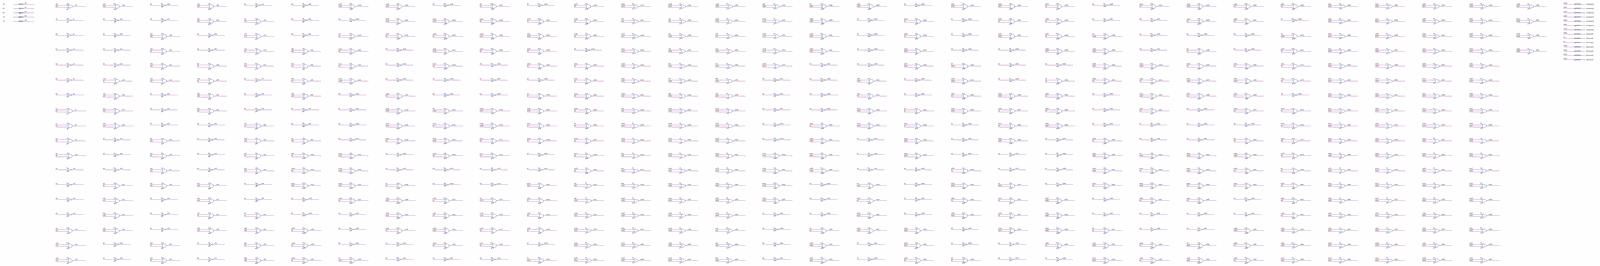
[diagram p0: schematic sheet, whole]
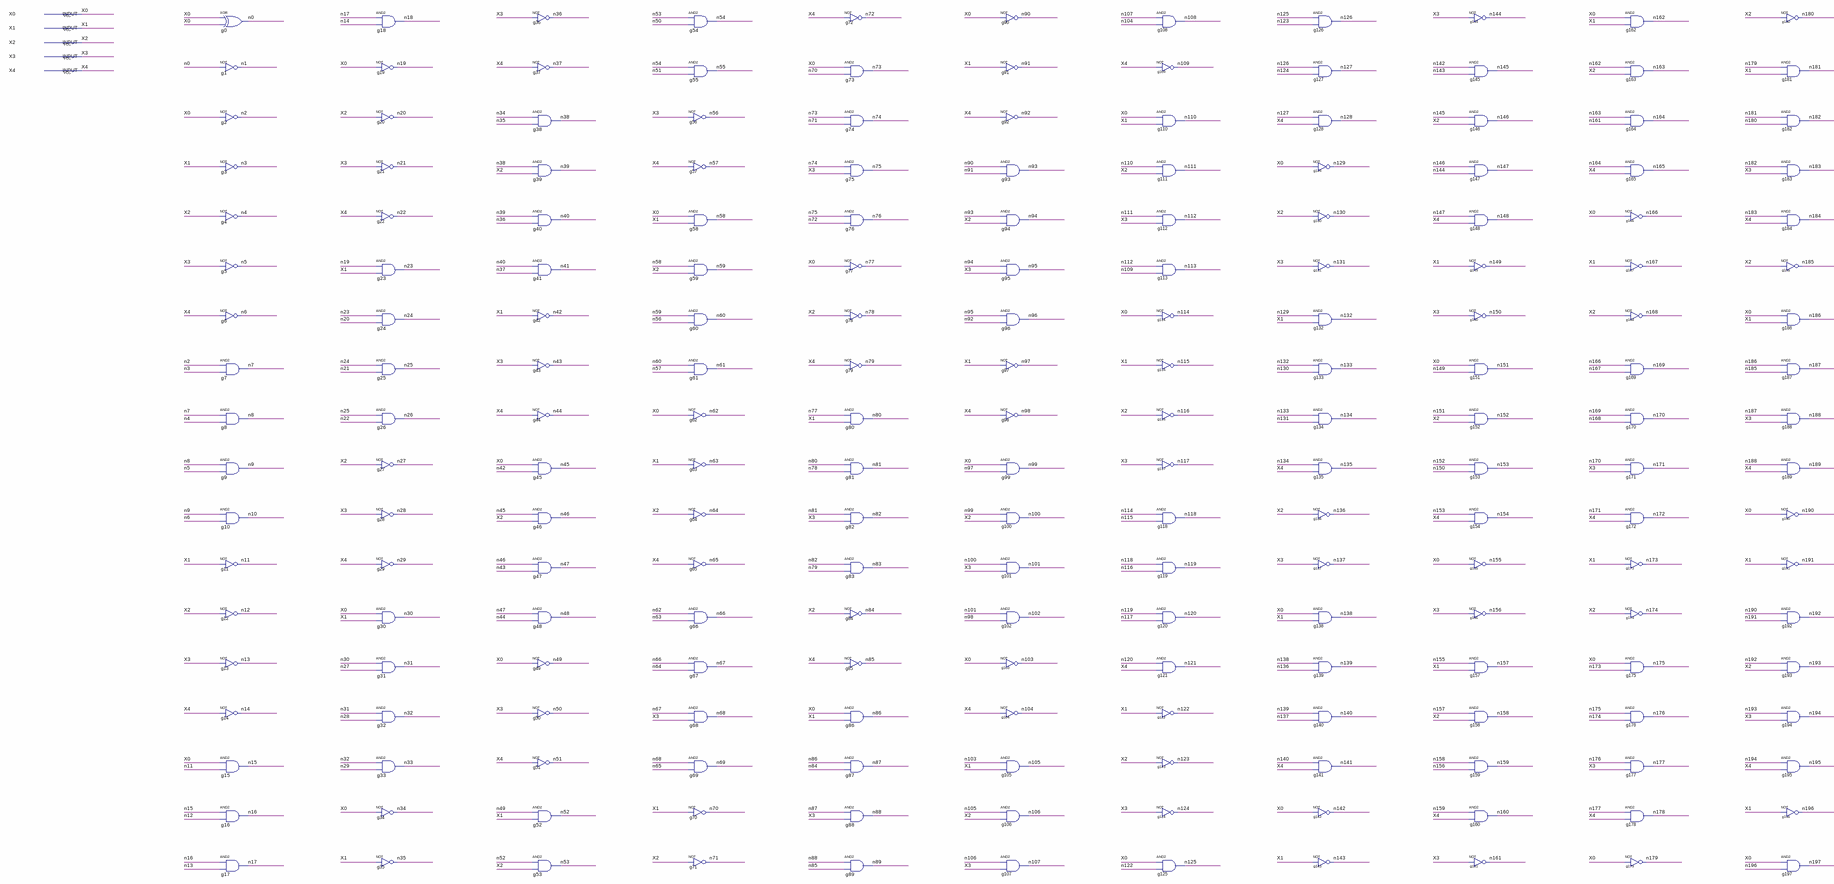
[diagram p1: schematic sheet, left part]
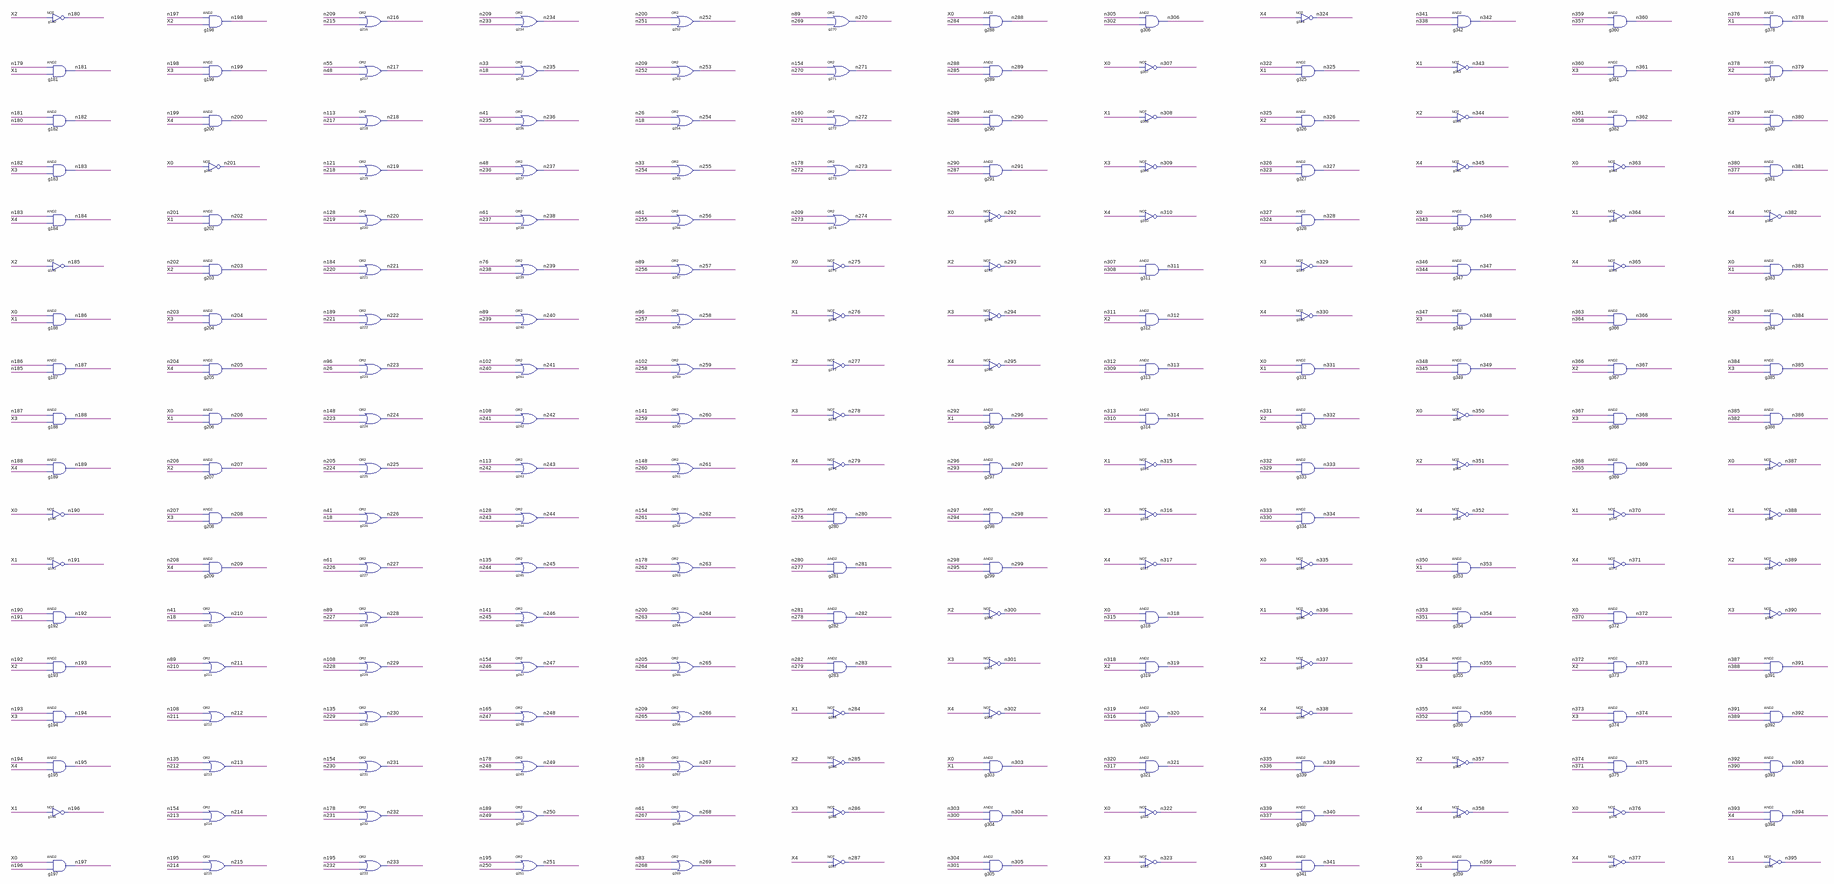
[diagram p2: schematic sheet, centre part]
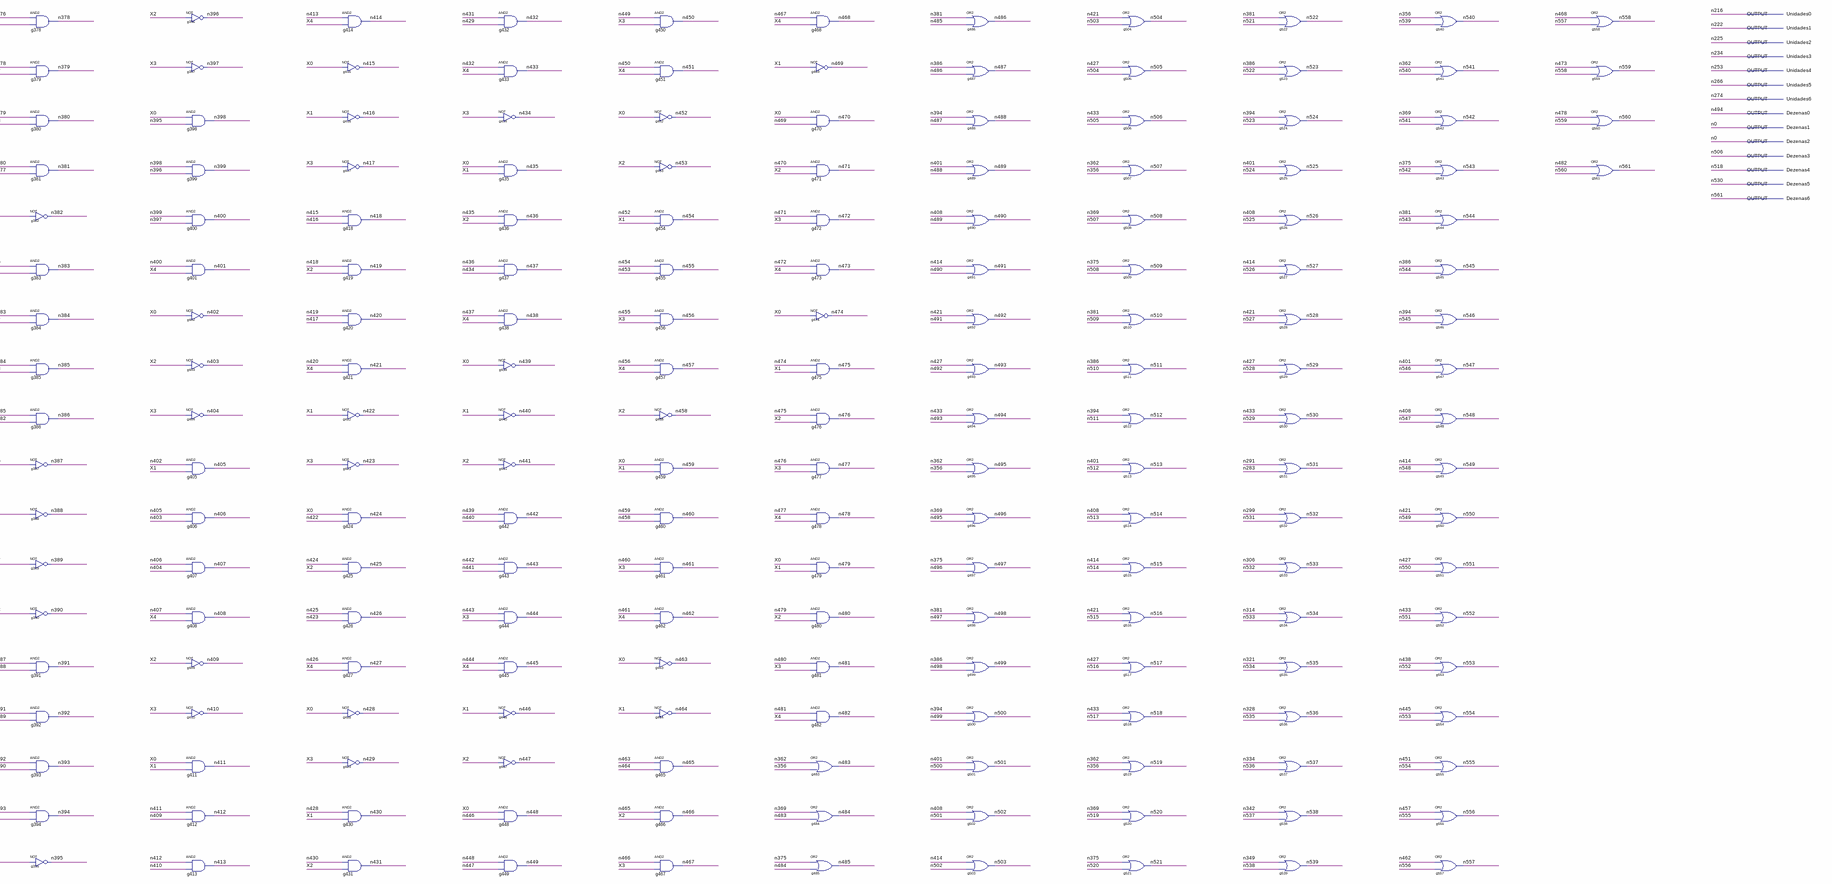
[diagram p3: schematic sheet, right part]
// Quartus schematic decoder_7seg.bdf as structural Verilog: 562 symbols, 19 pins
module decoder_7seg (
  input  X0,
  input  X1,
  input  X2,
  input  X3,
  input  X4,
  output Unidades0,
  output Unidades1,
  output Unidades2,
  output Unidades3,
  output Unidades4,
  output Unidades5,
  output Unidades6,
  output Dezenas0,
  output Dezenas1,
  output Dezenas2,
  output Dezenas3,
  output Dezenas4,
  output Dezenas5,
  output Dezenas6
);

  wire n1, n2, n3, n4, n5, n6, n7, n8, n9, n10, n11, n12, n13, n14, n15, n16, n17, n18, n19, n20, n21, n22,
       n23, n24, n25, n26, n27, n28, n29, n30, n31, n32, n33, n34, n35, n36, n37, n38, n39, n40, n41, n42,
       n43, n44, n45, n46, n47, n48, n49, n50, n51, n52, n53, n54, n55, n56, n57, n58, n59, n60, n61, n62,
       n63, n64, n65, n66, n67, n68, n69, n70, n71, n72, n73, n74, n75, n76, n77, n78, n79, n80, n81, n82,
       n83, n84, n85, n86, n87, n88, n89, n90, n91, n92, n93, n94, n95, n96, n97, n98, n99, n100, n101, n102,
       n103, n104, n105, n106, n107, n108, n109, n110, n111, n112, n113, n114, n115, n116, n117, n118, n119,
       n120, n121, n122, n123, n124, n125, n126, n127, n128, n129, n130, n131, n132, n133, n134, n135, n136,
       n137, n138, n139, n140, n141, n142, n143, n144, n145, n146, n147, n148, n149, n150, n151, n152, n153,
       n154, n155, n156, n157, n158, n159, n160, n161, n162, n163, n164, n165, n166, n167, n168, n169, n170,
       n171, n172, n173, n174, n175, n176, n177, n178, n179, n180, n181, n182, n183, n184, n185, n186, n187,
       n188, n189, n190, n191, n192, n193, n194, n195, n196, n197, n198, n199, n200, n201, n202, n203, n204,
       n205, n206, n207, n208, n209, n210, n211, n212, n213, n214, n215, n217, n218, n219, n220, n221, n223,
       n224, n226, n227, n228, n229, n230, n231, n232, n233, n235, n236, n237, n238, n239, n240, n241, n242,
       n243, n244, n245, n246, n247, n248, n249, n250, n251, n252, n254, n255, n256, n257, n258, n259, n260,
       n261, n262, n263, n264, n265, n267, n268, n269, n270, n271, n272, n273, n275, n276, n277, n278, n279,
       n280, n281, n282, n283, n284, n285, n286, n287, n288, n289, n290, n291, n292, n293, n294, n295, n296,
       n297, n298, n299, n300, n301, n302, n303, n304, n305, n306, n307, n308, n309, n310, n311, n312, n313,
       n314, n315, n316, n317, n318, n319, n320, n321, n322, n323, n324, n325, n326, n327, n328, n329, n330,
       n331, n332, n333, n334, n335, n336, n337, n338, n339, n340, n341, n342, n343, n344, n345, n346, n347,
       n348, n349, n350, n351, n352, n353, n354, n355, n356, n357, n358, n359, n360, n361, n362, n363, n364,
       n365, n366, n367, n368, n369, n370, n371, n372, n373, n374, n375, n376, n377, n378, n379, n380, n381,
       n382, n383, n384, n385, n386, n387, n388, n389, n390, n391, n392, n393, n394, n395, n396, n397, n398,
       n399, n400, n401, n402, n403, n404, n405, n406, n407, n408, n409, n410, n411, n412, n413, n414, n415,
       n416, n417, n418, n419, n420, n421, n422, n423, n424, n425, n426, n427, n428, n429, n430, n431, n432,
       n433, n434, n435, n436, n437, n438, n439, n440, n441, n442, n443, n444, n445, n446, n447, n448, n449,
       n450, n451, n452, n453, n454, n455, n456, n457, n458, n459, n460, n461, n462, n463, n464, n465, n466,
       n467, n468, n469, n470, n471, n472, n473, n474, n475, n476, n477, n478, n479, n480, n481, n482, n483,
       n484, n485, n486, n487, n488, n489, n490, n491, n492, n493, n495, n496, n497, n498, n499, n500, n501,
       n502, n503, n504, n505, n507, n508, n509, n510, n511, n512, n513, n514, n515, n516, n517, n519, n520,
       n521, n522, n523, n524, n525, n526, n527, n528, n529, n531, n532, n533, n534, n535, n536, n537, n538,
       n539, n540, n541, n542, n543, n544, n545, n546, n547, n548, n549, n550, n551, n552, n553, n554, n555,
       n556, n557, n558, n559, n560;

  xor g0 (Dezenas1, X0, X0);
  not g1 (n1, Dezenas1);
  not g2 (n2, X0);
  not g3 (n3, X1);
  not g4 (n4, X2);
  not g5 (n5, X3);
  not g6 (n6, X4);
  and g7 (n7, n2, n3);
  and g8 (n8, n7, n4);
  and g9 (n9, n8, n5);
  and g10 (n10, n9, n6);
  not g11 (n11, X1);
  not g12 (n12, X2);
  not g13 (n13, X3);
  not g14 (n14, X4);
  and g15 (n15, X0, n11);
  and g16 (n16, n15, n12);
  and g17 (n17, n16, n13);
  and g18 (n18, n17, n14);
  not g19 (n19, X0);
  not g20 (n20, X2);
  not g21 (n21, X3);
  not g22 (n22, X4);
  and g23 (n23, n19, X1);
  and g24 (n24, n23, n20);
  and g25 (n25, n24, n21);
  and g26 (n26, n25, n22);
  not g27 (n27, X2);
  not g28 (n28, X3);
  not g29 (n29, X4);
  and g30 (n30, X0, X1);
  and g31 (n31, n30, n27);
  and g32 (n32, n31, n28);
  and g33 (n33, n32, n29);
  not g34 (n34, X0);
  not g35 (n35, X1);
  not g36 (n36, X3);
  not g37 (n37, X4);
  and g38 (n38, n34, n35);
  and g39 (n39, n38, X2);
  and g40 (n40, n39, n36);
  and g41 (n41, n40, n37);
  not g42 (n42, X1);
  not g43 (n43, X3);
  not g44 (n44, X4);
  and g45 (n45, X0, n42);
  and g46 (n46, n45, X2);
  and g47 (n47, n46, n43);
  and g48 (n48, n47, n44);
  not g49 (n49, X0);
  not g50 (n50, X3);
  not g51 (n51, X4);
  and g52 (n52, n49, X1);
  and g53 (n53, n52, X2);
  and g54 (n54, n53, n50);
  and g55 (n55, n54, n51);
  not g56 (n56, X3);
  not g57 (n57, X4);
  and g58 (n58, X0, X1);
  and g59 (n59, n58, X2);
  and g60 (n60, n59, n56);
  and g61 (n61, n60, n57);
  not g62 (n62, X0);
  not g63 (n63, X1);
  not g64 (n64, X2);
  not g65 (n65, X4);
  and g66 (n66, n62, n63);
  and g67 (n67, n66, n64);
  and g68 (n68, n67, X3);
  and g69 (n69, n68, n65);
  not g70 (n70, X1);
  not g71 (n71, X2);
  not g72 (n72, X4);
  and g73 (n73, X0, n70);
  and g74 (n74, n73, n71);
  and g75 (n75, n74, X3);
  and g76 (n76, n75, n72);
  not g77 (n77, X0);
  not g78 (n78, X2);
  not g79 (n79, X4);
  and g80 (n80, n77, X1);
  and g81 (n81, n80, n78);
  and g82 (n82, n81, X3);
  and g83 (n83, n82, n79);
  not g84 (n84, X2);
  not g85 (n85, X4);
  and g86 (n86, X0, X1);
  and g87 (n87, n86, n84);
  and g88 (n88, n87, X3);
  and g89 (n89, n88, n85);
  not g90 (n90, X0);
  not g91 (n91, X1);
  not g92 (n92, X4);
  and g93 (n93, n90, n91);
  and g94 (n94, n93, X2);
  and g95 (n95, n94, X3);
  and g96 (n96, n95, n92);
  not g97 (n97, X1);
  not g98 (n98, X4);
  and g99 (n99, X0, n97);
  and g100 (n100, n99, X2);
  and g101 (n101, n100, X3);
  and g102 (n102, n101, n98);
  not g103 (n103, X0);
  not g104 (n104, X4);
  and g105 (n105, n103, X1);
  and g106 (n106, n105, X2);
  and g107 (n107, n106, X3);
  and g108 (n108, n107, n104);
  not g109 (n109, X4);
  and g110 (n110, X0, X1);
  and g111 (n111, n110, X2);
  and g112 (n112, n111, X3);
  and g113 (n113, n112, n109);
  not g114 (n114, X0);
  not g115 (n115, X1);
  not g116 (n116, X2);
  not g117 (n117, X3);
  and g118 (n118, n114, n115);
  and g119 (n119, n118, n116);
  and g120 (n120, n119, n117);
  and g121 (n121, n120, X4);
  not g122 (n122, X1);
  not g123 (n123, X2);
  not g124 (n124, X3);
  and g125 (n125, X0, n122);
  and g126 (n126, n125, n123);
  and g127 (n127, n126, n124);
  and g128 (n128, n127, X4);
  not g129 (n129, X0);
  not g130 (n130, X2);
  not g131 (n131, X3);
  and g132 (n132, n129, X1);
  and g133 (n133, n132, n130);
  and g134 (n134, n133, n131);
  and g135 (n135, n134, X4);
  not g136 (n136, X2);
  not g137 (n137, X3);
  and g138 (n138, X0, X1);
  and g139 (n139, n138, n136);
  and g140 (n140, n139, n137);
  and g141 (n141, n140, X4);
  not g142 (n142, X0);
  not g143 (n143, X1);
  not g144 (n144, X3);
  and g145 (n145, n142, n143);
  and g146 (n146, n145, X2);
  and g147 (n147, n146, n144);
  and g148 (n148, n147, X4);
  not g149 (n149, X1);
  not g150 (n150, X3);
  and g151 (n151, X0, n149);
  and g152 (n152, n151, X2);
  and g153 (n153, n152, n150);
  and g154 (n154, n153, X4);
  not g155 (n155, X0);
  not g156 (n156, X3);
  and g157 (n157, n155, X1);
  and g158 (n158, n157, X2);
  and g159 (n159, n158, n156);
  and g160 (n160, n159, X4);
  not g161 (n161, X3);
  and g162 (n162, X0, X1);
  and g163 (n163, n162, X2);
  and g164 (n164, n163, n161);
  and g165 (n165, n164, X4);
  not g166 (n166, X0);
  not g167 (n167, X1);
  not g168 (n168, X2);
  and g169 (n169, n166, n167);
  and g170 (n170, n169, n168);
  and g171 (n171, n170, X3);
  and g172 (n172, n171, X4);
  not g173 (n173, X1);
  not g174 (n174, X2);
  and g175 (n175, X0, n173);
  and g176 (n176, n175, n174);
  and g177 (n177, n176, X3);
  and g178 (n178, n177, X4);
  not g179 (n179, X0);
  not g180 (n180, X2);
  and g181 (n181, n179, X1);
  and g182 (n182, n181, n180);
  and g183 (n183, n182, X3);
  and g184 (n184, n183, X4);
  not g185 (n185, X2);
  and g186 (n186, X0, X1);
  and g187 (n187, n186, n185);
  and g188 (n188, n187, X3);
  and g189 (n189, n188, X4);
  not g190 (n190, X0);
  not g191 (n191, X1);
  and g192 (n192, n190, n191);
  and g193 (n193, n192, X2);
  and g194 (n194, n193, X3);
  and g195 (n195, n194, X4);
  not g196 (n196, X1);
  and g197 (n197, X0, n196);
  and g198 (n198, n197, X2);
  and g199 (n199, n198, X3);
  and g200 (n200, n199, X4);
  not g201 (n201, X0);
  and g202 (n202, n201, X1);
  and g203 (n203, n202, X2);
  and g204 (n204, n203, X3);
  and g205 (n205, n204, X4);
  and g206 (n206, X0, X1);
  and g207 (n207, n206, X2);
  and g208 (n208, n207, X3);
  and g209 (n209, n208, X4);
  or g210 (n210, n41, n18);
  or g211 (n211, n89, n210);
  or g212 (n212, n108, n211);
  or g213 (n213, n135, n212);
  or g214 (n214, n154, n213);
  or g215 (n215, n195, n214);
  or g216 (Unidades0, n209, n215);
  or g217 (n217, n55, n48);
  or g218 (n218, n113, n217);
  or g219 (n219, n121, n218);
  or g220 (n220, n128, n219);
  or g221 (n221, n184, n220);
  or g222 (Unidades1, n189, n221);
  or g223 (n223, n96, n26);
  or g224 (n224, n148, n223);
  or g225 (Unidades2, n205, n224);
  or g226 (n226, n41, n18);
  or g227 (n227, n61, n226);
  or g228 (n228, n89, n227);
  or g229 (n229, n108, n228);
  or g230 (n230, n135, n229);
  or g231 (n231, n154, n230);
  or g232 (n232, n178, n231);
  or g233 (n233, n195, n232);
  or g234 (Unidades3, n209, n233);
  or g235 (n235, n33, n18);
  or g236 (n236, n41, n235);
  or g237 (n237, n48, n236);
  or g238 (n238, n61, n237);
  or g239 (n239, n76, n238);
  or g240 (n240, n89, n239);
  or g241 (n241, n102, n240);
  or g242 (n242, n108, n241);
  or g243 (n243, n113, n242);
  or g244 (n244, n128, n243);
  or g245 (n245, n135, n244);
  or g246 (n246, n141, n245);
  or g247 (n247, n154, n246);
  or g248 (n248, n165, n247);
  or g249 (n249, n178, n248);
  or g250 (n250, n189, n249);
  or g251 (n251, n195, n250);
  or g252 (n252, n200, n251);
  or g253 (Unidades4, n209, n252);
  or g254 (n254, n26, n18);
  or g255 (n255, n33, n254);
  or g256 (n256, n61, n255);
  or g257 (n257, n89, n256);
  or g258 (n258, n96, n257);
  or g259 (n259, n102, n258);
  or g260 (n260, n141, n259);
  or g261 (n261, n148, n260);
  or g262 (n262, n154, n261);
  or g263 (n263, n178, n262);
  or g264 (n264, n200, n263);
  or g265 (n265, n205, n264);
  or g266 (Unidades5, n209, n265);
  or g267 (n267, n18, n10);
  or g268 (n268, n61, n267);
  or g269 (n269, n83, n268);
  or g270 (n270, n89, n269);
  or g271 (n271, n154, n270);
  or g272 (n272, n160, n271);
  or g273 (n273, n178, n272);
  or g274 (Unidades6, n209, n273);
  not g275 (n275, X0);
  not g276 (n276, X1);
  not g277 (n277, X2);
  not g278 (n278, X3);
  not g279 (n279, X4);
  and g280 (n280, n275, n276);
  and g281 (n281, n280, n277);
  and g282 (n282, n281, n278);
  and g283 (n283, n282, n279);
  not g284 (n284, X1);
  not g285 (n285, X2);
  not g286 (n286, X3);
  not g287 (n287, X4);
  and g288 (n288, X0, n284);
  and g289 (n289, n288, n285);
  and g290 (n290, n289, n286);
  and g291 (n291, n290, n287);
  not g292 (n292, X0);
  not g293 (n293, X2);
  not g294 (n294, X3);
  not g295 (n295, X4);
  and g296 (n296, n292, X1);
  and g297 (n297, n296, n293);
  and g298 (n298, n297, n294);
  and g299 (n299, n298, n295);
  not g300 (n300, X2);
  not g301 (n301, X3);
  not g302 (n302, X4);
  and g303 (n303, X0, X1);
  and g304 (n304, n303, n300);
  and g305 (n305, n304, n301);
  and g306 (n306, n305, n302);
  not g307 (n307, X0);
  not g308 (n308, X1);
  not g309 (n309, X3);
  not g310 (n310, X4);
  and g311 (n311, n307, n308);
  and g312 (n312, n311, X2);
  and g313 (n313, n312, n309);
  and g314 (n314, n313, n310);
  not g315 (n315, X1);
  not g316 (n316, X3);
  not g317 (n317, X4);
  and g318 (n318, X0, n315);
  and g319 (n319, n318, X2);
  and g320 (n320, n319, n316);
  and g321 (n321, n320, n317);
  not g322 (n322, X0);
  not g323 (n323, X3);
  not g324 (n324, X4);
  and g325 (n325, n322, X1);
  and g326 (n326, n325, X2);
  and g327 (n327, n326, n323);
  and g328 (n328, n327, n324);
  not g329 (n329, X3);
  not g330 (n330, X4);
  and g331 (n331, X0, X1);
  and g332 (n332, n331, X2);
  and g333 (n333, n332, n329);
  and g334 (n334, n333, n330);
  not g335 (n335, X0);
  not g336 (n336, X1);
  not g337 (n337, X2);
  not g338 (n338, X4);
  and g339 (n339, n335, n336);
  and g340 (n340, n339, n337);
  and g341 (n341, n340, X3);
  and g342 (n342, n341, n338);
  not g343 (n343, X1);
  not g344 (n344, X2);
  not g345 (n345, X4);
  and g346 (n346, X0, n343);
  and g347 (n347, n346, n344);
  and g348 (n348, n347, X3);
  and g349 (n349, n348, n345);
  not g350 (n350, X0);
  not g351 (n351, X2);
  not g352 (n352, X4);
  and g353 (n353, n350, X1);
  and g354 (n354, n353, n351);
  and g355 (n355, n354, X3);
  and g356 (n356, n355, n352);
  not g357 (n357, X2);
  not g358 (n358, X4);
  and g359 (n359, X0, X1);
  and g360 (n360, n359, n357);
  and g361 (n361, n360, X3);
  and g362 (n362, n361, n358);
  not g363 (n363, X0);
  not g364 (n364, X1);
  not g365 (n365, X4);
  and g366 (n366, n363, n364);
  and g367 (n367, n366, X2);
  and g368 (n368, n367, X3);
  and g369 (n369, n368, n365);
  not g370 (n370, X1);
  not g371 (n371, X4);
  and g372 (n372, X0, n370);
  and g373 (n373, n372, X2);
  and g374 (n374, n373, X3);
  and g375 (n375, n374, n371);
  not g376 (n376, X0);
  not g377 (n377, X4);
  and g378 (n378, n376, X1);
  and g379 (n379, n378, X2);
  and g380 (n380, n379, X3);
  and g381 (n381, n380, n377);
  not g382 (n382, X4);
  and g383 (n383, X0, X1);
  and g384 (n384, n383, X2);
  and g385 (n385, n384, X3);
  and g386 (n386, n385, n382);
  not g387 (n387, X0);
  not g388 (n388, X1);
  not g389 (n389, X2);
  not g390 (n390, X3);
  and g391 (n391, n387, n388);
  and g392 (n392, n391, n389);
  and g393 (n393, n392, n390);
  and g394 (n394, n393, X4);
  not g395 (n395, X1);
  not g396 (n396, X2);
  not g397 (n397, X3);
  and g398 (n398, X0, n395);
  and g399 (n399, n398, n396);
  and g400 (n400, n399, n397);
  and g401 (n401, n400, X4);
  not g402 (n402, X0);
  not g403 (n403, X2);
  not g404 (n404, X3);
  and g405 (n405, n402, X1);
  and g406 (n406, n405, n403);
  and g407 (n407, n406, n404);
  and g408 (n408, n407, X4);
  not g409 (n409, X2);
  not g410 (n410, X3);
  and g411 (n411, X0, X1);
  and g412 (n412, n411, n409);
  and g413 (n413, n412, n410);
  and g414 (n414, n413, X4);
  not g415 (n415, X0);
  not g416 (n416, X1);
  not g417 (n417, X3);
  and g418 (n418, n415, n416);
  and g419 (n419, n418, X2);
  and g420 (n420, n419, n417);
  and g421 (n421, n420, X4);
  not g422 (n422, X1);
  not g423 (n423, X3);
  and g424 (n424, X0, n422);
  and g425 (n425, n424, X2);
  and g426 (n426, n425, n423);
  and g427 (n427, n426, X4);
  not g428 (n428, X0);
  not g429 (n429, X3);
  and g430 (n430, n428, X1);
  and g431 (n431, n430, X2);
  and g432 (n432, n431, n429);
  and g433 (n433, n432, X4);
  not g434 (n434, X3);
  and g435 (n435, X0, X1);
  and g436 (n436, n435, X2);
  and g437 (n437, n436, n434);
  and g438 (n438, n437, X4);
  not g439 (n439, X0);
  not g440 (n440, X1);
  not g441 (n441, X2);
  and g442 (n442, n439, n440);
  and g443 (n443, n442, n441);
  and g444 (n444, n443, X3);
  and g445 (n445, n444, X4);
  not g446 (n446, X1);
  not g447 (n447, X2);
  and g448 (n448, X0, n446);
  and g449 (n449, n448, n447);
  and g450 (n450, n449, X3);
  and g451 (n451, n450, X4);
  not g452 (n452, X0);
  not g453 (n453, X2);
  and g454 (n454, n452, X1);
  and g455 (n455, n454, n453);
  and g456 (n456, n455, X3);
  and g457 (n457, n456, X4);
  not g458 (n458, X2);
  and g459 (n459, X0, X1);
  and g460 (n460, n459, n458);
  and g461 (n461, n460, X3);
  and g462 (n462, n461, X4);
  not g463 (n463, X0);
  not g464 (n464, X1);
  and g465 (n465, n463, n464);
  and g466 (n466, n465, X2);
  and g467 (n467, n466, X3);
  and g468 (n468, n467, X4);
  not g469 (n469, X1);
  and g470 (n470, X0, n469);
  and g471 (n471, n470, X2);
  and g472 (n472, n471, X3);
  and g473 (n473, n472, X4);
  not g474 (n474, X0);
  and g475 (n475, n474, X1);
  and g476 (n476, n475, X2);
  and g477 (n477, n476, X3);
  and g478 (n478, n477, X4);
  and g479 (n479, X0, X1);
  and g480 (n480, n479, X2);
  and g481 (n481, n480, X3);
  and g482 (n482, n481, X4);
  or g483 (n483, n362, n356);
  or g484 (n484, n369, n483);
  or g485 (n485, n375, n484);
  or g486 (n486, n381, n485);
  or g487 (n487, n386, n486);
  or g488 (n488, n394, n487);
  or g489 (n489, n401, n488);
  or g490 (n490, n408, n489);
  or g491 (n491, n414, n490);
  or g492 (n492, n421, n491);
  or g493 (n493, n427, n492);
  or g494 (Dezenas0, n433, n493);
  or g495 (n495, n362, n356);
  or g496 (n496, n369, n495);
  or g497 (n497, n375, n496);
  or g498 (n498, n381, n497);
  or g499 (n499, n386, n498);
  or g500 (n500, n394, n499);
  or g501 (n501, n401, n500);
  or g502 (n502, n408, n501);
  or g503 (n503, n414, n502);
  or g504 (n504, n421, n503);
  or g505 (n505, n427, n504);
  or g506 (Dezenas3, n433, n505);
  or g507 (n507, n362, n356);
  or g508 (n508, n369, n507);
  or g509 (n509, n375, n508);
  or g510 (n510, n381, n509);
  or g511 (n511, n386, n510);
  or g512 (n512, n394, n511);
  or g513 (n513, n401, n512);
  or g514 (n514, n408, n513);
  or g515 (n515, n414, n514);
  or g516 (n516, n421, n515);
  or g517 (n517, n427, n516);
  or g518 (Dezenas4, n433, n517);
  or g519 (n519, n362, n356);
  or g520 (n520, n369, n519);
  or g521 (n521, n375, n520);
  or g522 (n522, n381, n521);
  or g523 (n523, n386, n522);
  or g524 (n524, n394, n523);
  or g525 (n525, n401, n524);
  or g526 (n526, n408, n525);
  or g527 (n527, n414, n526);
  or g528 (n528, n421, n527);
  or g529 (n529, n427, n528);
  or g530 (Dezenas5, n433, n529);
  or g531 (n531, n291, n283);
  or g532 (n532, n299, n531);
  or g533 (n533, n306, n532);
  or g534 (n534, n314, n533);
  or g535 (n535, n321, n534);
  or g536 (n536, n328, n535);
  or g537 (n537, n334, n536);
  or g538 (n538, n342, n537);
  or g539 (n539, n349, n538);
  or g540 (n540, n356, n539);
  or g541 (n541, n362, n540);
  or g542 (n542, n369, n541);
  or g543 (n543, n375, n542);
  or g544 (n544, n381, n543);
  or g545 (n545, n386, n544);
  or g546 (n546, n394, n545);
  or g547 (n547, n401, n546);
  or g548 (n548, n408, n547);
  or g549 (n549, n414, n548);
  or g550 (n550, n421, n549);
  or g551 (n551, n427, n550);
  or g552 (n552, n433, n551);
  or g553 (n553, n438, n552);
  or g554 (n554, n445, n553);
  or g555 (n555, n451, n554);
  or g556 (n556, n457, n555);
  or g557 (n557, n462, n556);
  or g558 (n558, n468, n557);
  or g559 (n559, n473, n558);
  or g560 (n560, n478, n559);
  or g561 (Dezenas6, n482, n560);

  assign Dezenas2 = Dezenas1;

  // Other names for the same wires on the sheet: n0 = Dezenas1; n216 = Unidades0; n222 = Unidades1; n225 = Unidades2;
  //   n234 = Unidades3; n253 = Unidades4; n266 = Unidades5; n274 = Unidades6; n494 = Dezenas0; n506 = Dezenas3;
  //   n518 = Dezenas4; n530 = Dezenas5; n561 = Dezenas6
endmodule
